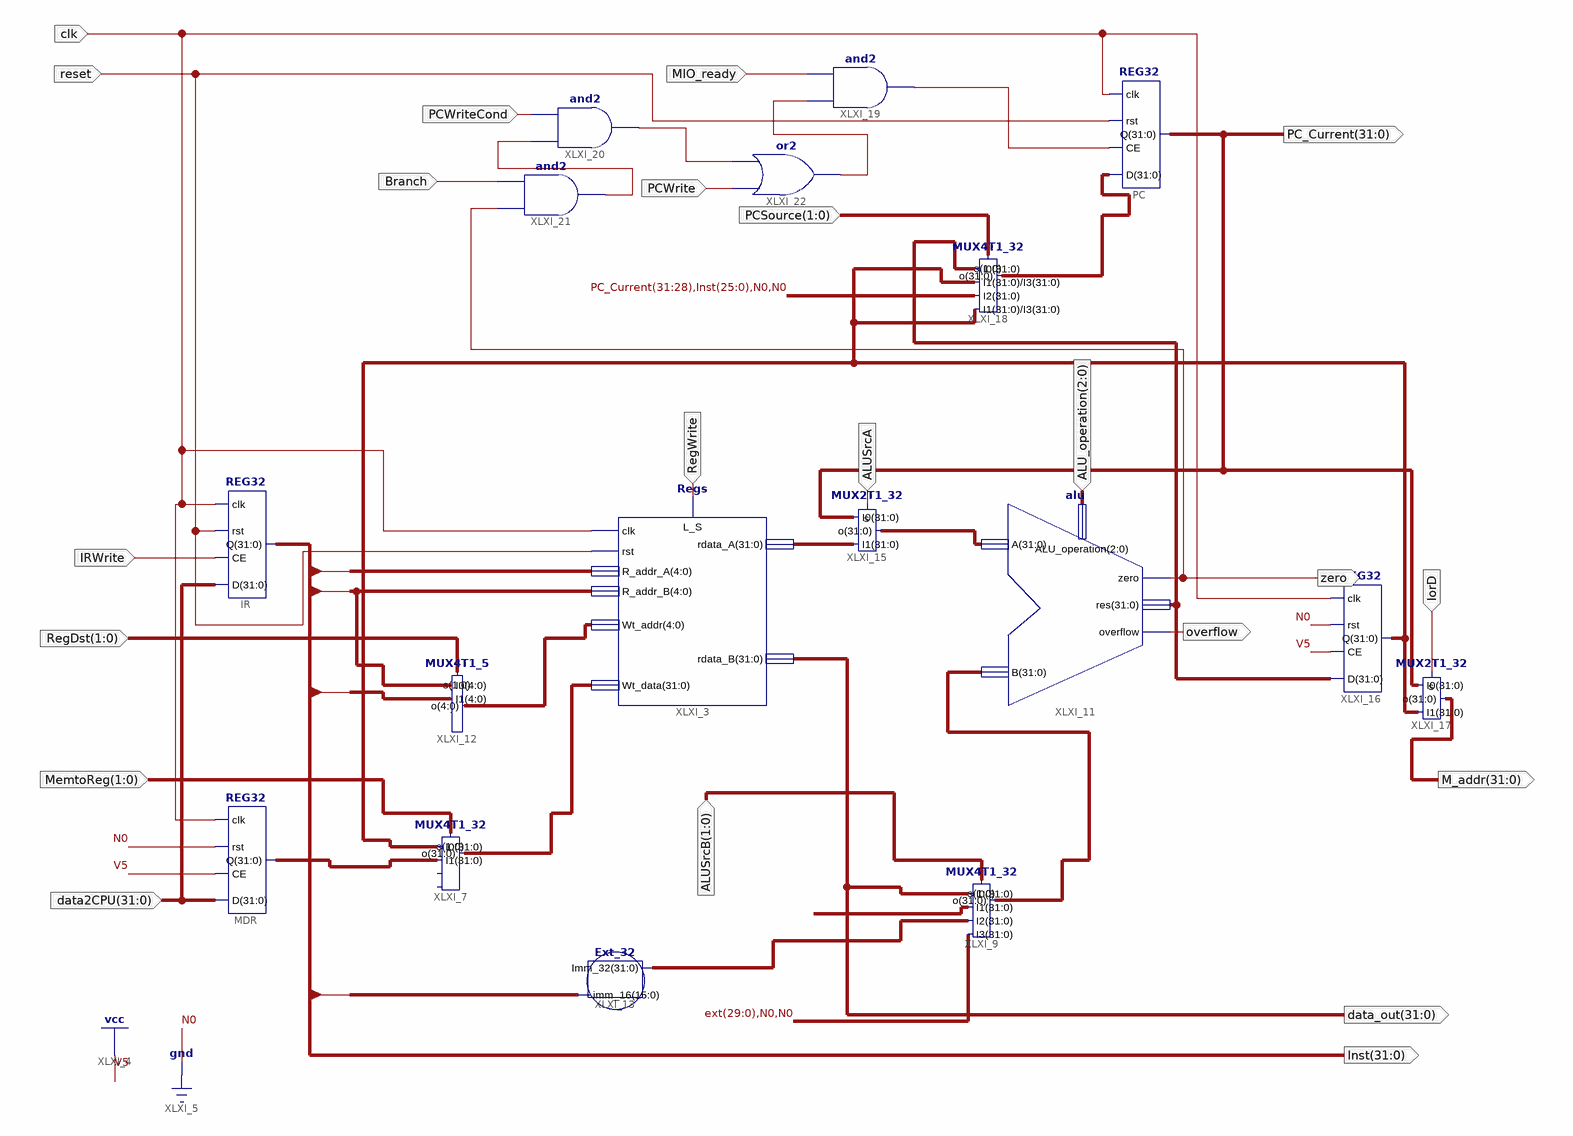
[diagram p0: schematic sheet 1]
// Xilinx ISE schematic MDPath.sch (kintex7) as structural Verilog: 17 symbols, 22 ports
module MDPath (
  input  [31:0] data2CPU,
  input  IRWrite,
  input  clk,
  input  reset,
  input  RegWrite,
  input  [1:0] RegDst,
  input  [1:0] MemtoReg,
  input  [1:0] ALUSrcB,
  input  ALUSrcA,
  input  [2:0] ALU_operation,
  input  IorD,
  input  MIO_ready,
  input  PCWrite,
  input  PCWriteCond,
  input  Branch,
  input  [1:0] PCSource,
  output [31:0] Inst,
  output [31:0] data_out,
  output [31:0] PC_Current,
  output overflow,
  output zero,
  output [31:0] M_addr
);

  wire XLXN_79, XLXN_81, XLXN_85, XLXN_87;
  wire [4:0] XLXN_22;
  wire [31:0] ext, XLXN_26, XLXN_27, XLXN_34, XLXN_45, XLXN_46, XLXN_55, XLXN_78, XLXN_90;

  REG32 IR (.D(data2CPU), .CE(IRWrite), .rst(reset), .clk(clk), .Q(Inst));
  REG32 MDR (.D(data2CPU), .CE(1'b1), .rst(1'b0), .clk(clk), .Q(XLXN_26));
  Regs XLXI_3 (
    .clk(clk), .L_S(RegWrite), .rdata_A(XLXN_45), .rst(reset), .Wt_data(XLXN_27), .rdata_B(data_out),
    .R_addr_A(Inst[25:21]), .R_addr_B(Inst[20:16]), .Wt_addr(XLXN_22));
  MUX4T1_32 XLXI_7 (.s(MemtoReg), .I0(XLXN_90), .I1(XLXN_26), .o(XLXN_27));  // open: I2, I3
  MUX4T1_32 XLXI_9 (
    .s(ALUSrcB), .I0(data_out), .I1(32'b00000000000000000000000000000100), .I2(ext), .I3({ext[29:0], 2'b00}),
    .o(XLXN_34));
  alu XLXI_11 (
    .zero(zero), .res(XLXN_55), .overflow(overflow), .A(XLXN_46), .B(XLXN_34), .ALU_operation(ALU_operation));
  MUX4T1_5 XLXI_12 (.s(RegDst), .I1(Inst[15:11]), .I0(Inst[20:16]), .o(XLXN_22));  // open: I2, I3
  Ext_32 XLXI_13 (.imm_16(Inst[15:0]), .Imm_32(ext));
  REG32 PC (.D(XLXN_78), .CE(XLXN_79), .rst(reset), .clk(clk), .Q(PC_Current));
  MUX2T1_32 XLXI_15 (.s(ALUSrcA), .I0(PC_Current), .I1(XLXN_45), .o(XLXN_46));
  REG32 XLXI_16 (.D(XLXN_55), .CE(1'b1), .rst(1'b0), .clk(clk), .Q(XLXN_90));
  MUX2T1_32 XLXI_17 (.s(IorD), .I0(PC_Current), .I1(XLXN_90), .o(M_addr));
  MUX4T1_32 XLXI_18 (
    .s(PCSource), .I0(XLXN_55), .I1(XLXN_90), .I2({PC_Current[31:28], Inst[25:0], 2'b00}), .I3(XLXN_90),
    .o(XLXN_78));
  and XLXI_19 (XLXN_79, XLXN_81, MIO_ready);
  and XLXI_20 (XLXN_85, XLXN_87, PCWriteCond);
  and XLXI_21 (XLXN_87, zero, Branch);
  or XLXI_22 (XLXN_81, PCWrite, XLXN_85);
endmodule
